# Altium schematic sheet Row.SchDoc
size B; SheetNumber: 1; SheetTotal: 3
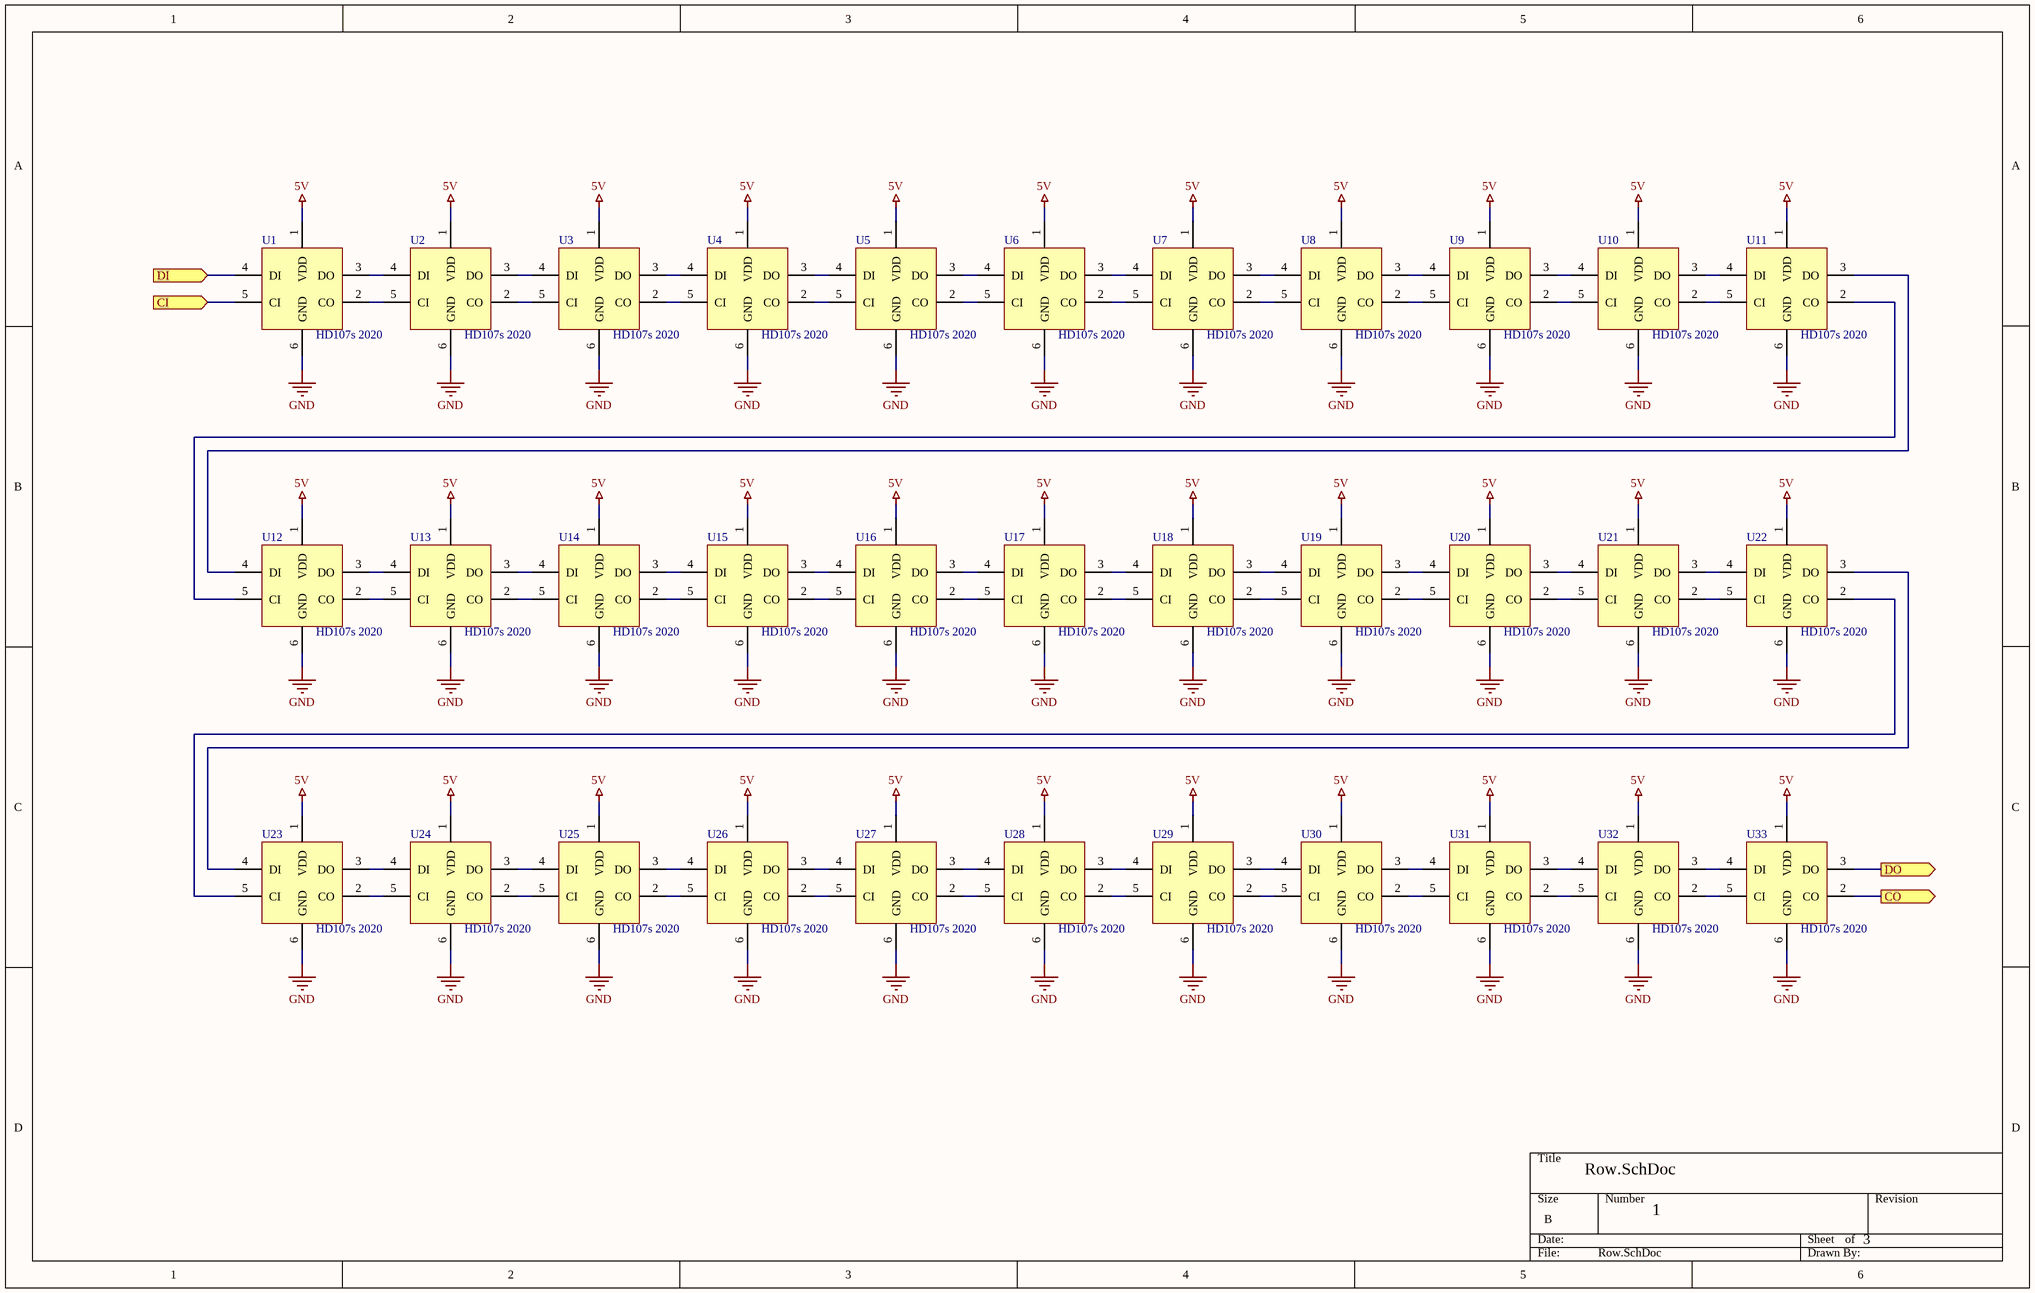
[diagram p0: Row.SchDoc]

## Parts
U1  HD107s 2020  [LED_HD107s-2020]
U2  HD107s 2020  [LED_HD107s-2020]
U3  HD107s 2020  [LED_HD107s-2020]
U4  HD107s 2020  [LED_HD107s-2020]
U5  HD107s 2020  [LED_HD107s-2020]
U6  HD107s 2020  [LED_HD107s-2020]
U7  HD107s 2020  [LED_HD107s-2020]
U8  HD107s 2020  [LED_HD107s-2020]
U9  HD107s 2020  [LED_HD107s-2020]
U10  HD107s 2020  [LED_HD107s-2020]
U11  HD107s 2020  [LED_HD107s-2020]
U12  HD107s 2020  [LED_HD107s-2020]
U13  HD107s 2020  [LED_HD107s-2020]
U14  HD107s 2020  [LED_HD107s-2020]
U15  HD107s 2020  [LED_HD107s-2020]
U16  HD107s 2020  [LED_HD107s-2020]
U17  HD107s 2020  [LED_HD107s-2020]
U18  HD107s 2020  [LED_HD107s-2020]
U19  HD107s 2020  [LED_HD107s-2020]
U20  HD107s 2020  [LED_HD107s-2020]
U21  HD107s 2020  [LED_HD107s-2020]
U22  HD107s 2020  [LED_HD107s-2020]
U23  HD107s 2020  [LED_HD107s-2020]
U24  HD107s 2020  [LED_HD107s-2020]
U25  HD107s 2020  [LED_HD107s-2020]
U26  HD107s 2020  [LED_HD107s-2020]
U27  HD107s 2020  [LED_HD107s-2020]
U28  HD107s 2020  [LED_HD107s-2020]
U29  HD107s 2020  [LED_HD107s-2020]
U30  HD107s 2020  [LED_HD107s-2020]
U31  HD107s 2020  [LED_HD107s-2020]
U32  HD107s 2020  [LED_HD107s-2020]
U33  HD107s 2020  [LED_HD107s-2020]

## Ports
CI (in), CO (out), DI (in), DO (out)

## Nets
5V: U1.1(VDD) U2.1(VDD) U3.1(VDD) U4.1(VDD) U5.1(VDD) U6.1(VDD) U7.1(VDD) U8.1(VDD) U9.1(VDD) U10.1(VDD) U11.1(VDD) U12.1(VDD) U13.1(VDD) U14.1(VDD) U15.1(VDD) U16.1(VDD) U17.1(VDD) U18.1(VDD) U19.1(VDD) U20.1(VDD) U21.1(VDD) U22.1(VDD) U23.1(VDD) U24.1(VDD) U25.1(VDD) U26.1(VDD) U27.1(VDD) U28.1(VDD) U29.1(VDD) U30.1(VDD) U31.1(VDD) U32.1(VDD) U33.1(VDD)
GND: U1.6(GND) U2.6(GND) U3.6(GND) U4.6(GND) U5.6(GND) U6.6(GND) U7.6(GND) U8.6(GND) U9.6(GND) U10.6(GND) U11.6(GND) U12.6(GND) U13.6(GND) U14.6(GND) U15.6(GND) U16.6(GND) U17.6(GND) U18.6(GND) U19.6(GND) U20.6(GND) U21.6(GND) U22.6(GND) U23.6(GND) U24.6(GND) U25.6(GND) U26.6(GND) U27.6(GND) U28.6(GND) U29.6(GND) U30.6(GND) U31.6(GND) U32.6(GND) U33.6(GND)
CI: U1.5(CI) ; port CI
CO: U33.2(CO) ; port CO
DI: U1.4(DI) ; port DI
DO: U33.3(DO) ; port DO
NetU1_2: U1.2(CO) U2.5(CI)
NetU1_3: U1.3(DO) U2.4(DI)
NetU2_2: U2.2(CO) U3.5(CI)
NetU2_3: U2.3(DO) U3.4(DI)
NetU3_2: U3.2(CO) U4.5(CI)
NetU3_3: U3.3(DO) U4.4(DI)
NetU4_2: U4.2(CO) U5.5(CI)
NetU4_3: U4.3(DO) U5.4(DI)
NetU5_2: U5.2(CO) U6.5(CI)
NetU5_3: U5.3(DO) U6.4(DI)
NetU6_2: U6.2(CO) U7.5(CI)
NetU6_3: U6.3(DO) U7.4(DI)
NetU7_2: U7.2(CO) U8.5(CI)
NetU7_3: U7.3(DO) U8.4(DI)
NetU8_2: U8.2(CO) U9.5(CI)
NetU8_3: U8.3(DO) U9.4(DI)
NetU9_2: U9.2(CO) U10.5(CI)
NetU9_3: U9.3(DO) U10.4(DI)
NetU10_2: U10.2(CO) U11.5(CI)
NetU10_3: U10.3(DO) U11.4(DI)
NetU11_2: U11.2(CO) U12.5(CI)
NetU11_3: U11.3(DO) U12.4(DI)
NetU12_2: U12.2(CO) U13.5(CI)
NetU12_3: U12.3(DO) U13.4(DI)
NetU13_2: U13.2(CO) U14.5(CI)
NetU13_3: U13.3(DO) U14.4(DI)
NetU14_2: U14.2(CO) U15.5(CI)
NetU14_3: U14.3(DO) U15.4(DI)
NetU15_2: U15.2(CO) U16.5(CI)
NetU15_3: U15.3(DO) U16.4(DI)
NetU16_2: U16.2(CO) U17.5(CI)
NetU16_3: U16.3(DO) U17.4(DI)
NetU17_2: U17.2(CO) U18.5(CI)
NetU17_3: U17.3(DO) U18.4(DI)
NetU18_2: U18.2(CO) U19.5(CI)
NetU18_3: U18.3(DO) U19.4(DI)
NetU19_2: U19.2(CO) U20.5(CI)
NetU19_3: U19.3(DO) U20.4(DI)
NetU20_2: U20.2(CO) U21.5(CI)
NetU20_3: U20.3(DO) U21.4(DI)
NetU21_2: U21.2(CO) U22.5(CI)
NetU21_3: U21.3(DO) U22.4(DI)
NetU22_2: U22.2(CO) U23.5(CI)
NetU22_3: U22.3(DO) U23.4(DI)
NetU23_2: U23.2(CO) U24.5(CI)
NetU23_3: U23.3(DO) U24.4(DI)
NetU24_2: U24.2(CO) U25.5(CI)
NetU24_3: U24.3(DO) U25.4(DI)
NetU25_2: U25.2(CO) U26.5(CI)
NetU25_3: U25.3(DO) U26.4(DI)
NetU26_2: U26.2(CO) U27.5(CI)
NetU26_3: U26.3(DO) U27.4(DI)
NetU27_2: U27.2(CO) U28.5(CI)
NetU27_3: U27.3(DO) U28.4(DI)
NetU28_2: U28.2(CO) U29.5(CI)
NetU28_3: U28.3(DO) U29.4(DI)
NetU29_2: U29.2(CO) U30.5(CI)
NetU29_3: U29.3(DO) U30.4(DI)
NetU30_2: U30.2(CO) U31.5(CI)
NetU30_3: U30.3(DO) U31.4(DI)
NetU31_2: U31.2(CO) U32.5(CI)
NetU31_3: U31.3(DO) U32.4(DI)
NetU32_2: U32.2(CO) U33.5(CI)
NetU32_3: U32.3(DO) U33.4(DI)

## Library data of the parts
U1-U33 = HD107s-2020: 8-pin type LED three-color RGB Dimming control; MP: APA-102-2020-256-8; MF: iPixel LED Light Co.; Value: *; SnapEDA_Link: https://www.snapeda.com/parts/APA-102-2020-256-8/iPixel%20LED%20Light%20Co./view-part/698331/?ref=snap; Availability: Unavailable; Package: SMD-8 iPixel LED Light Co.; Price: None